# EAGLE design mezistanicni (EAGLE 9.6.2)
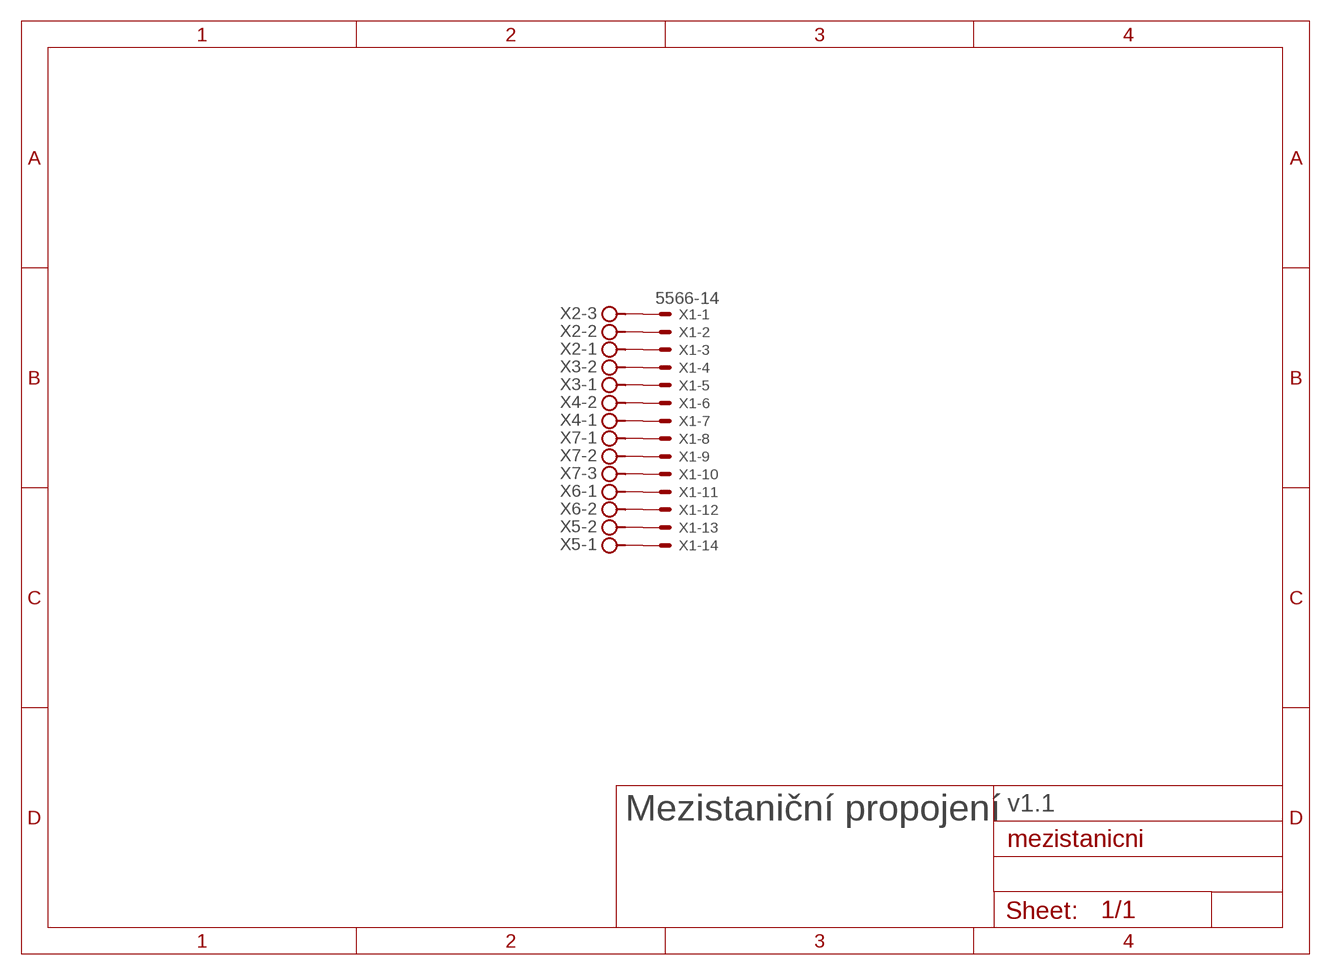
[diagram p0: schematic, sheet 1]

## Parts
X1  5566-14  [5566-14]
X2  MVE253-5-V  [MVE253-5-V]
X3  MVE252-5-V  [MVE252-5-V]
X4  ARK550/2  [ARK550/2]
X5  ARK550/2  [ARK550/2]
X6  MVE252-5-V  [MVE252-5-V]
X7  MVE253-5-V  [MVE253-5-V]

## Nets
B-AC+: X1.9 X7.2
B-AC-GND: X1.8 X7.1
DCC-C: X1.14 X5.1
DCC-D: X1.13 X5.2
GND: X1.1 X2.3
MTB: X1.2 X2.2
MTBBUS+: X1.7 X4.1
MTBBUS-: X1.6 X4.2
NC1: X1.12 X6.2
NC2: X1.11 X6.1
NC3: X1.10 X7.3
POM: X1.3 X2.1
PREST: X1.5 X3.1
ROZP: X1.4 X3.2

## Notes on the sheet
- v1.1
- Mezistaniční propojení

## Library data of the parts
X1 = con-molex:5566-14: Mini FIT connector 14 pol Source: http://www.molex.com; MF: MOLEX; OC_FARNELL: unknown; OC_NEWARK: unknown
X2 X7 = con-malina:MVE253-5-V
X3 X6 = con-malina:MVE252-5-V
X4 X5 = con-malina:ARK550/2

## Board
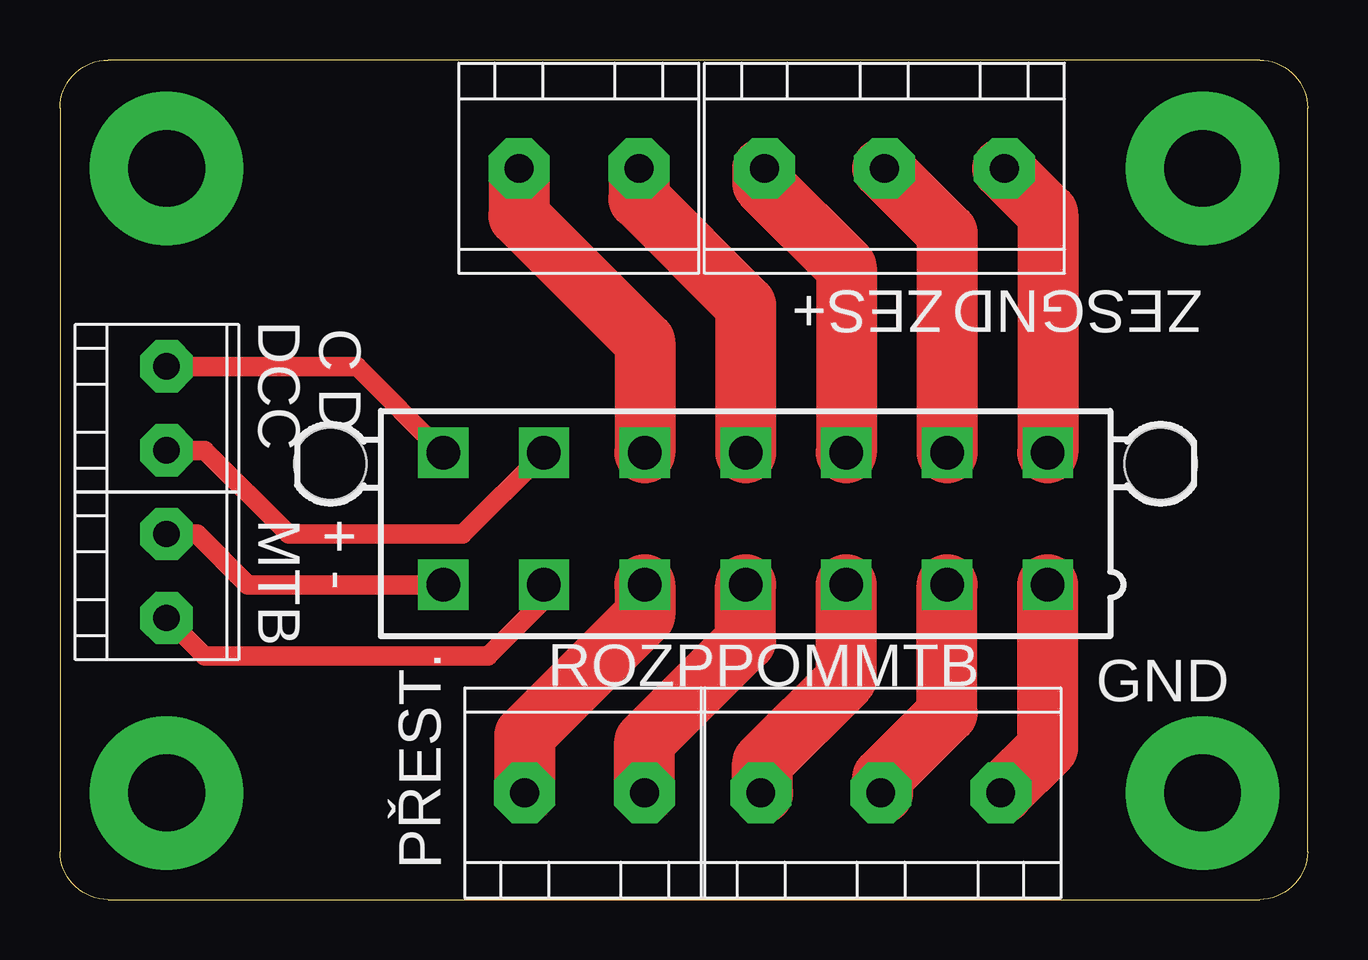
[diagram p1: board, top side]
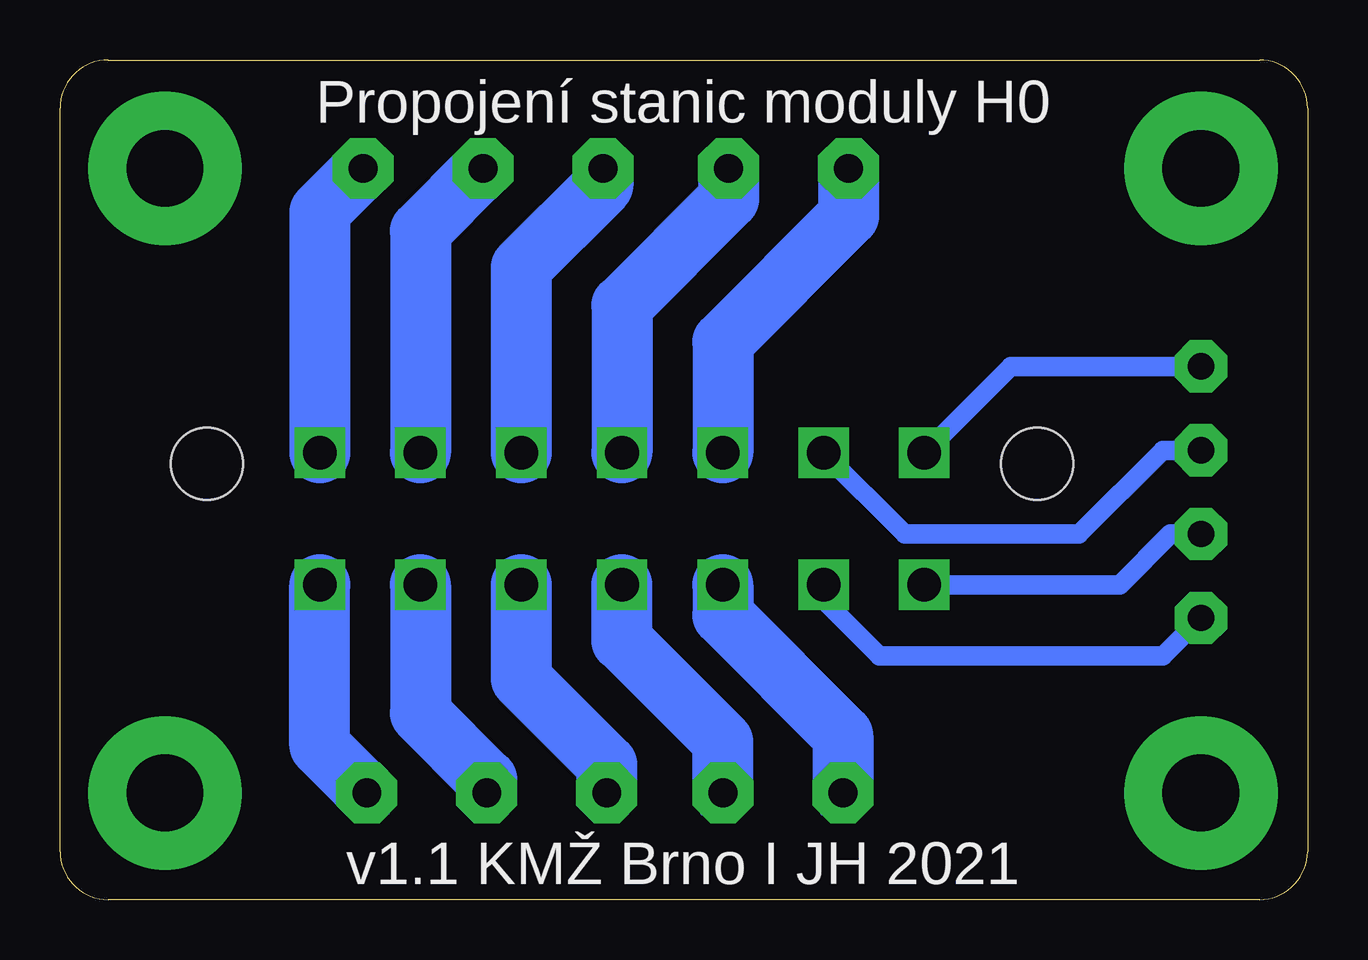
[diagram p2: board, bottom side, seen from below]

Size 52 x 35 mm. Coordinates in mm from the lower left corner, seen from the top.
Outline: 2,0 50,0 arc90 52,2 52,33 arc90 50,35 2,35 arc90 0,33 0,2 arc90 2,0
Copper layers (1*16): Top 0.035mm / dielectric 0.15mm / Bottom 0.035mm
Design rules "default": minimum track width 6mil, minimum drill 0.35mm, track to track 6mil, track to pad 6mil, pad to pad 6mil, via to via 6mil, smd to smd 6mil, copper to edge 40mil, drill to drill 6mil, minimum pad ring 10mil, minimum via ring 8mil, stop-mask expansion 4mil, vias tented up to drill 0mil, thermal gap 10mil

### Footprints (pad centres in the part's own frame; a part is rotated, then mirrored left to right if it is on the bottom)
5566-14 = drill 1.4 square: 1 12.6,-2.75; 2 8.4,-2.75; 3 4.2,-2.75; 4 0,-2.75; 5 -4.2,-2.75; 6 -8.4,-2.75; 7 -12.6,-2.75; 8 12.6,2.75; 9 8.4,2.75; 10 4.2,2.75; 11 0,2.75; 12 -4.2,2.75; 13 -8.4,2.75; 14 -12.6,2.75 | hole 3: 17.3,2.29; -17.3,2.29
MVE253-5-V = drill 1.2 pad 2.54 octagon: 1 0,0; 2 5,0; 3 10,0
MVE252-5-V = drill 1.2 pad 2.54 octagon: 1 0,0; 2 5,0
ARK550/2 = drill 1.1 pad 2.184 octagon: 1 0,0; 2 3.5,0

### Placement (x,y rotation side)
X1  28.57,15.88 0 top
X2  29.21,4.45 0 top
X3  19.37,4.45 0 top
X4  4.45,15.24 270 top
X5  4.45,22.23 270 top
X6  24.13,30.48 180 top
X7  39.37,30.48 180 top

### Tracks (layer width: path | path; a pad name or v marks a point on that pad's centre or on a via)
B-AC+
  Bottom 2.54: X7.2 36.98,27.88 X1.9
B-AC+1
  Top 2.54: 34.29,30.48 36.98,27.8 36.98,18.62
B-AC-GND
  Bottom 2.54: X7.1 41.17,28.68 X1.8
B-AC-GND1
  Top 2.54: 39.29,30.48 41.17,28.59 41.17,18.62
DCC-C
  Bottom 0.813: X1.14 12.38,22.23 X5.1
DCC-C1
  Top 0.813: 15.97,18.62 12.38,22.23 4.45,22.23
DCC-D
  Bottom 0.813: X1.13 16.79,15.24 9.53,15.24 6.04,18.73 X5.2
DCC-D1
  Top 0.813: 20.18,18.62 16.79,15.24 9.53,15.24 6.04,18.73 4.45,18.73
GND
  Bottom 2.54: X2.3 41.17,6.41 X1.1
GND1
  Top 2.54: 39.29,4.45 41.17,6.33 41.17,13.12
MTB
  Bottom 2.54: X1.2 36.98,7.76 34.21,5 X2.2
MTB1
  Top 2.54: 34.29,4.45 34.29,5.08 36.98,7.76 36.98,13.12
MTBBUS+
  Bottom 0.813: X4.1 5.71,15.24 7.83,13.12 X1.7
MTBBUS+1
  Top 0.813: 4.45,15.24 5.71,15.24 7.83,13.12 15.97,13.12
MTBBUS-
  Bottom 0.813: X4.2 6.03,10.16 17.84,10.16 20.18,12.49 X1.6
MTBBUS-1
  Top 0.813: 4.45,11.74 6.03,10.16 17.84,10.16 20.18,12.49 20.18,13.12
N$1  (via drill 3.2 pad 6.4)
  other vias: 47.62,30.48
N$16  (via drill 3.2 pad 6.4)
  other vias: 4.45,4.45
N$17  (via drill 3.2 pad 6.4)
  other vias: 4.45,30.48
N$18  (via drill 3.2 pad 6.4)
  other vias: 47.62,4.45
NC1
  Bottom 2.54: X6.2 19.13,28.5 24.38,23.25 X1.12
NC2
  Bottom 2.54: X6.1 24.13,29.21 28.57,24.77 X1.11
NC3
  Bottom 2.54: X1.10 32.77,26.36 29.37,29.77 X7.3
NC4
  Top 2.54: 24.13,30.48 24.13,29.21 28.57,24.77 28.57,18.62
NC5
  Top 2.54: 19.13,30.48 19.13,28.5 24.38,23.25 24.38,18.62
NC6
  Top 2.54: 29.29,30.48 29.29,29.84 32.77,26.36 32.77,18.62
POM
  Bottom 2.54: X1.3 32.77,9.2 29.21,5.63 X2.1
POM1
  Top 2.54: 29.29,4.45 29.29,5.71 32.77,9.2 32.77,13.12
PREST
  Bottom 2.54: X1.5 24.38,11.86 19.37,6.85 X3.1
PREST1
  Top 2.54: 24.38,13.12 24.38,11.86 19.37,6.85 19.37,4.45
ROZP
  Bottom 2.54: X3.2 24.37,6.59 28.57,10.79 X1.4
ROZP1
  Top 2.54: 24.37,4.45 24.37,6.59 28.57,10.79 28.57,13.12

### Text on the board
tNames: ZES+ | ZESGND | DCC | C D | MTB | + - | ROZP | POM | MTB | GND | PŘEST.
bNames: Propojení stanic moduly H0 | v1.1 KMŽ Brno I JH 2021